# Altium schematic sheet POWER.SchDoc
size A4
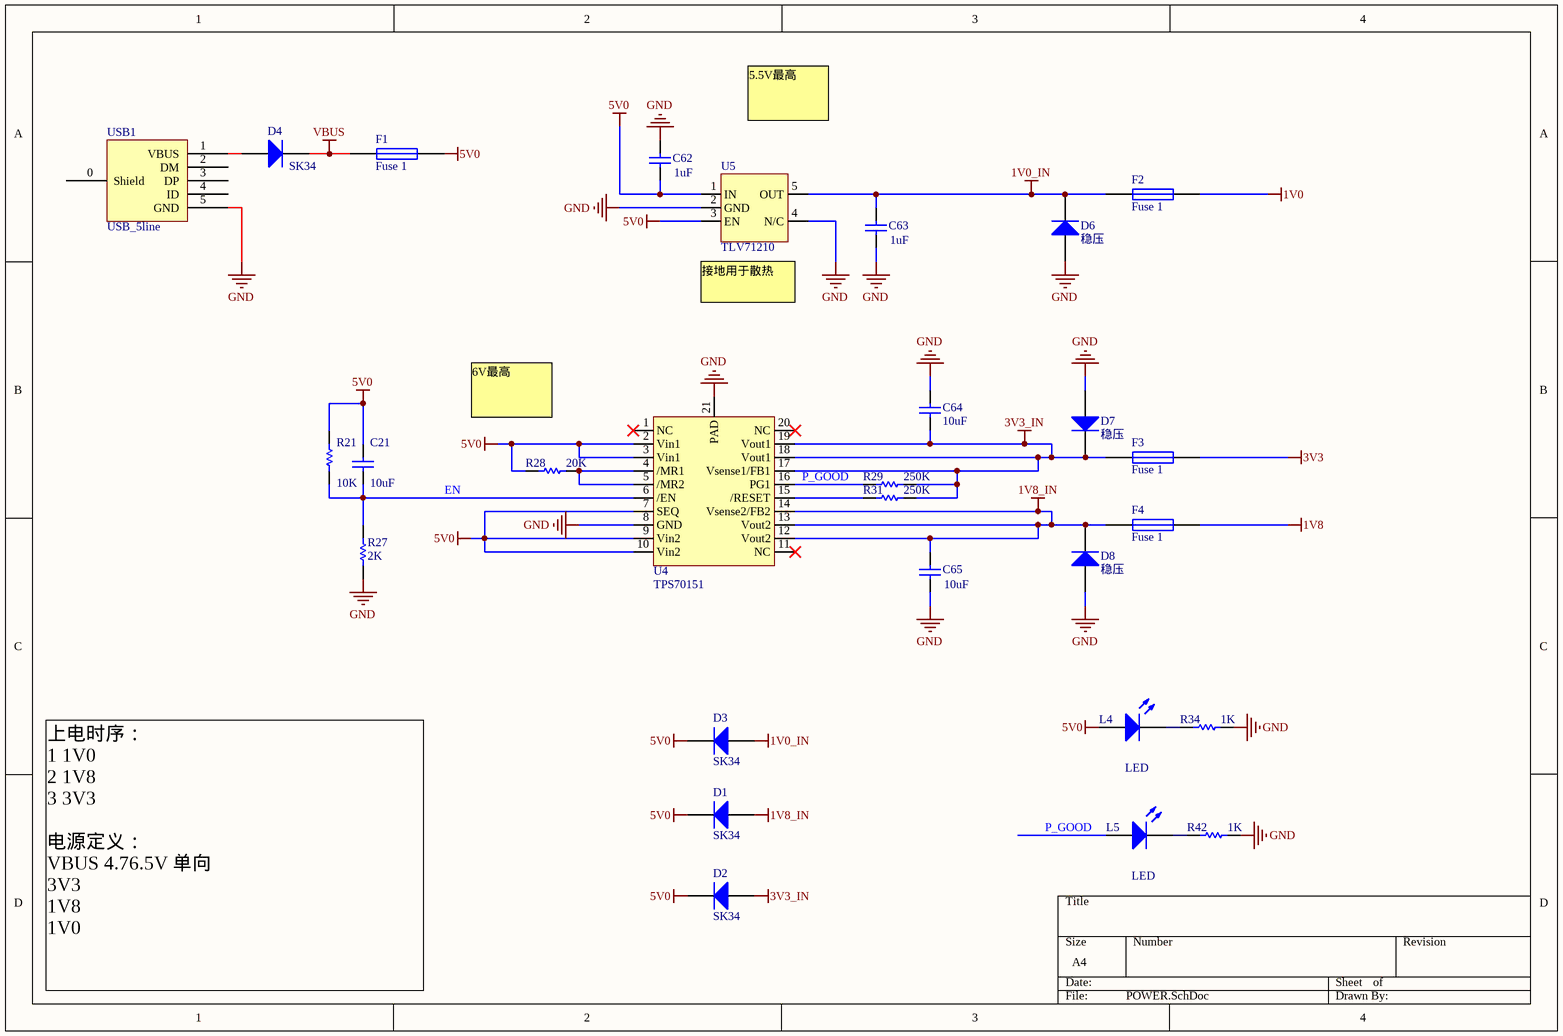
[diagram p0: POWER.SchDoc]

## Parts
C21  value 10uF  [1608[0603]]  (hidden comment: Cap)
C62  value 1uF  [1608[0603]]  (hidden comment: Cap)
C63  value 1uF  [1608[0603]]  (hidden comment: Cap)
C64  value 10uF  [1608[0603]]  (hidden comment: Cap)
C65  value 10uF  [1608[0603]]  (hidden comment: Cap)
D1  SK34  [1206]
D2  SK34  [1206]
D3  SK34  [1206]
D4  SK34  [1206]
D6  稳压  [1206]
D7  稳压  [1206]
D8  稳压  [1206]
F1  Fuse 1  [1206]
F2  Fuse 1  [1206]
F3  Fuse 1  [1206]
F4  Fuse 1  [1206]
L4  LED  [1608[0603]]
L5  LED  [1608[0603]]
R21  value 10K  [1608[0603]]  (hidden comment: Res)
R27  value 2K  [1608[0603]]  (hidden comment: Res)
R28  value 20K  [1608[0603]]  (hidden comment: Res)
R29  value 250K  [1608[0603]]  (hidden comment: Res)
R31  value 250K  [1608[0603]]  (hidden comment: Res)
R34  value 1K  [1608[0603]]  (hidden comment: Res)
R42  value 1K  [1608[0603]]  (hidden comment: Res)
U4  TPS70151  [TPS701]
U5  TLV71210  [TLV712]
USB1  USB_5line  [USB-MICRO-5P-2F]

## Nets
1V0: F2.1
1V0_IN: C63.1 D3.1(A) D6.2(K) F2.2 U5.5(OUT)
1V8: F4.1
1V8_IN: C65.1 D1.1(A) D8.2(K) F4.2 U4.12(Vout2) U4.13(Vout2) U4.14(Vsense2/FB2)
3V3: F3.1
3V3_IN: C64.1 D2.1(A) D7.2(K) F3.2 R29.1 R31.1 U4.17(Vsense1/FB1) U4.18(Vout1) U4.19(Vout1)
5V0: C21.1 C62.2 D1.2(K) D2.2(K) D3.2(K) F1.1 L4.1(A) R21.1 R28.2 U4.2(Vin1) U4.3(Vin1) U4.7(SEQ) U4.9(Vin2) U4.10(Vin2) U5.1(IN) U5.3(EN)
GND: C62.1 C63.2 C64.2 C65.2 D6.1(A) D7.1(A) D8.1(A) R27.2 R34.1 R42.1 U4.8(GND) U4.21(PAD) U5.2(GND) U5.4(N/C) USB1.5(GND)
VBUS: D4.2(K) F1.2
EN: C21.2 R21.2 R27.1 U4.6(/EN)
P_GOOD: L5.1(A) R29.2 U4.16(PG1)
NetD4_1: D4.1(A) USB1.1(VBUS)
NetL4_2: L4.2(K) R34.2
NetL5_2: L5.2(K) R42.2
NetR28_1: R28.1 U4.4(/MR1) U4.5(/MR2)
NetR31_2: R31.2 U4.15(/RESET)

Not connected (* = marked no-connect by the designer): U4 1(NC)* 11(NC)* 20(NC)*; USB1 0(Shield) 2(DM) 3(DP) 4(ID)

## Notes on the sheet
- 5.5V最高
- (near U5) 接地用于散热
- 6V最高
- 上电时序：
  1 1V0
  2 1V8
  3 3V3
  电源定义：
  VBUS 4.76.5V 单向
  3V3
  1V8
  1V0

## Library data of the parts
C21 C62-C65 = Cap: 贴片电容; Published: 8-Jun-2000; LatestRevisionDate: 17-Jul-2002; LatestRevisionNote: Re-released for DXP Platform.; PackageReference: RAD-0.3; Publisher: Altium Limited
D1-D4 D6-D8 = Diode 1N4148: High Conductance Fast Diode; LatestRevisionDate: 17-Jul-2002; LatestRevisionNote: Re-released for DXP Platform.; DatasheetDocument: 1997; PackageReference: DO-35; Publisher: Altium Limited; Code_JEDEC: DO-204-AH; ComponentLink1Description: Manufacturer Link; ComponentLink2Description: Datasheet; ComponentLink2URL: http://www.fairchildsemi.com/ds/1N%2F1N4148.pdf
F1-F4 = Fuse 1: Fuse; Published: 8-Jun-2000; LatestRevisionDate: 17-Jul-2002; LatestRevisionNote: Re-released for DXP Platform.; PackageReference: PIN-W2/E2.8; Publisher: Altium Limited; PackageDescription: Thru-Hole; 2 Leads
R21 R27-R29 R31 R34 R42 = Res: 贴片电阻; Published: 8-Jun-2000; LatestRevisionDate: 17-Jul-2002; LatestRevisionNote: Re-released for DXP Platform.; PackageReference: AXIAL-0.3; Publisher: Altium Limited
U4 = TPS701
U5 = TLV712